# Altium schematic sheet 780-00021_rev1,pg1,3-Chan IR Thermocouple Apps Module.SchDoc
size C; PageSetup: Record=PageOptions|CenterHorizontal=True|CenterVertical=True|PrintScale=0.70|XCorrection=1.00|YCorrection=1.00|PrintKind=0|BorderSize=5000000|LeftOffset=0|BottomOffset=0|Orientation=2|PaperLength=1000|PaperWidth=1000|Scale=100|PaperSource=7|PrintQuality=-4|MediaType=1|DitherType=10|PaperKind=Tabloid 11 x 17in|PrintScaleMode=1
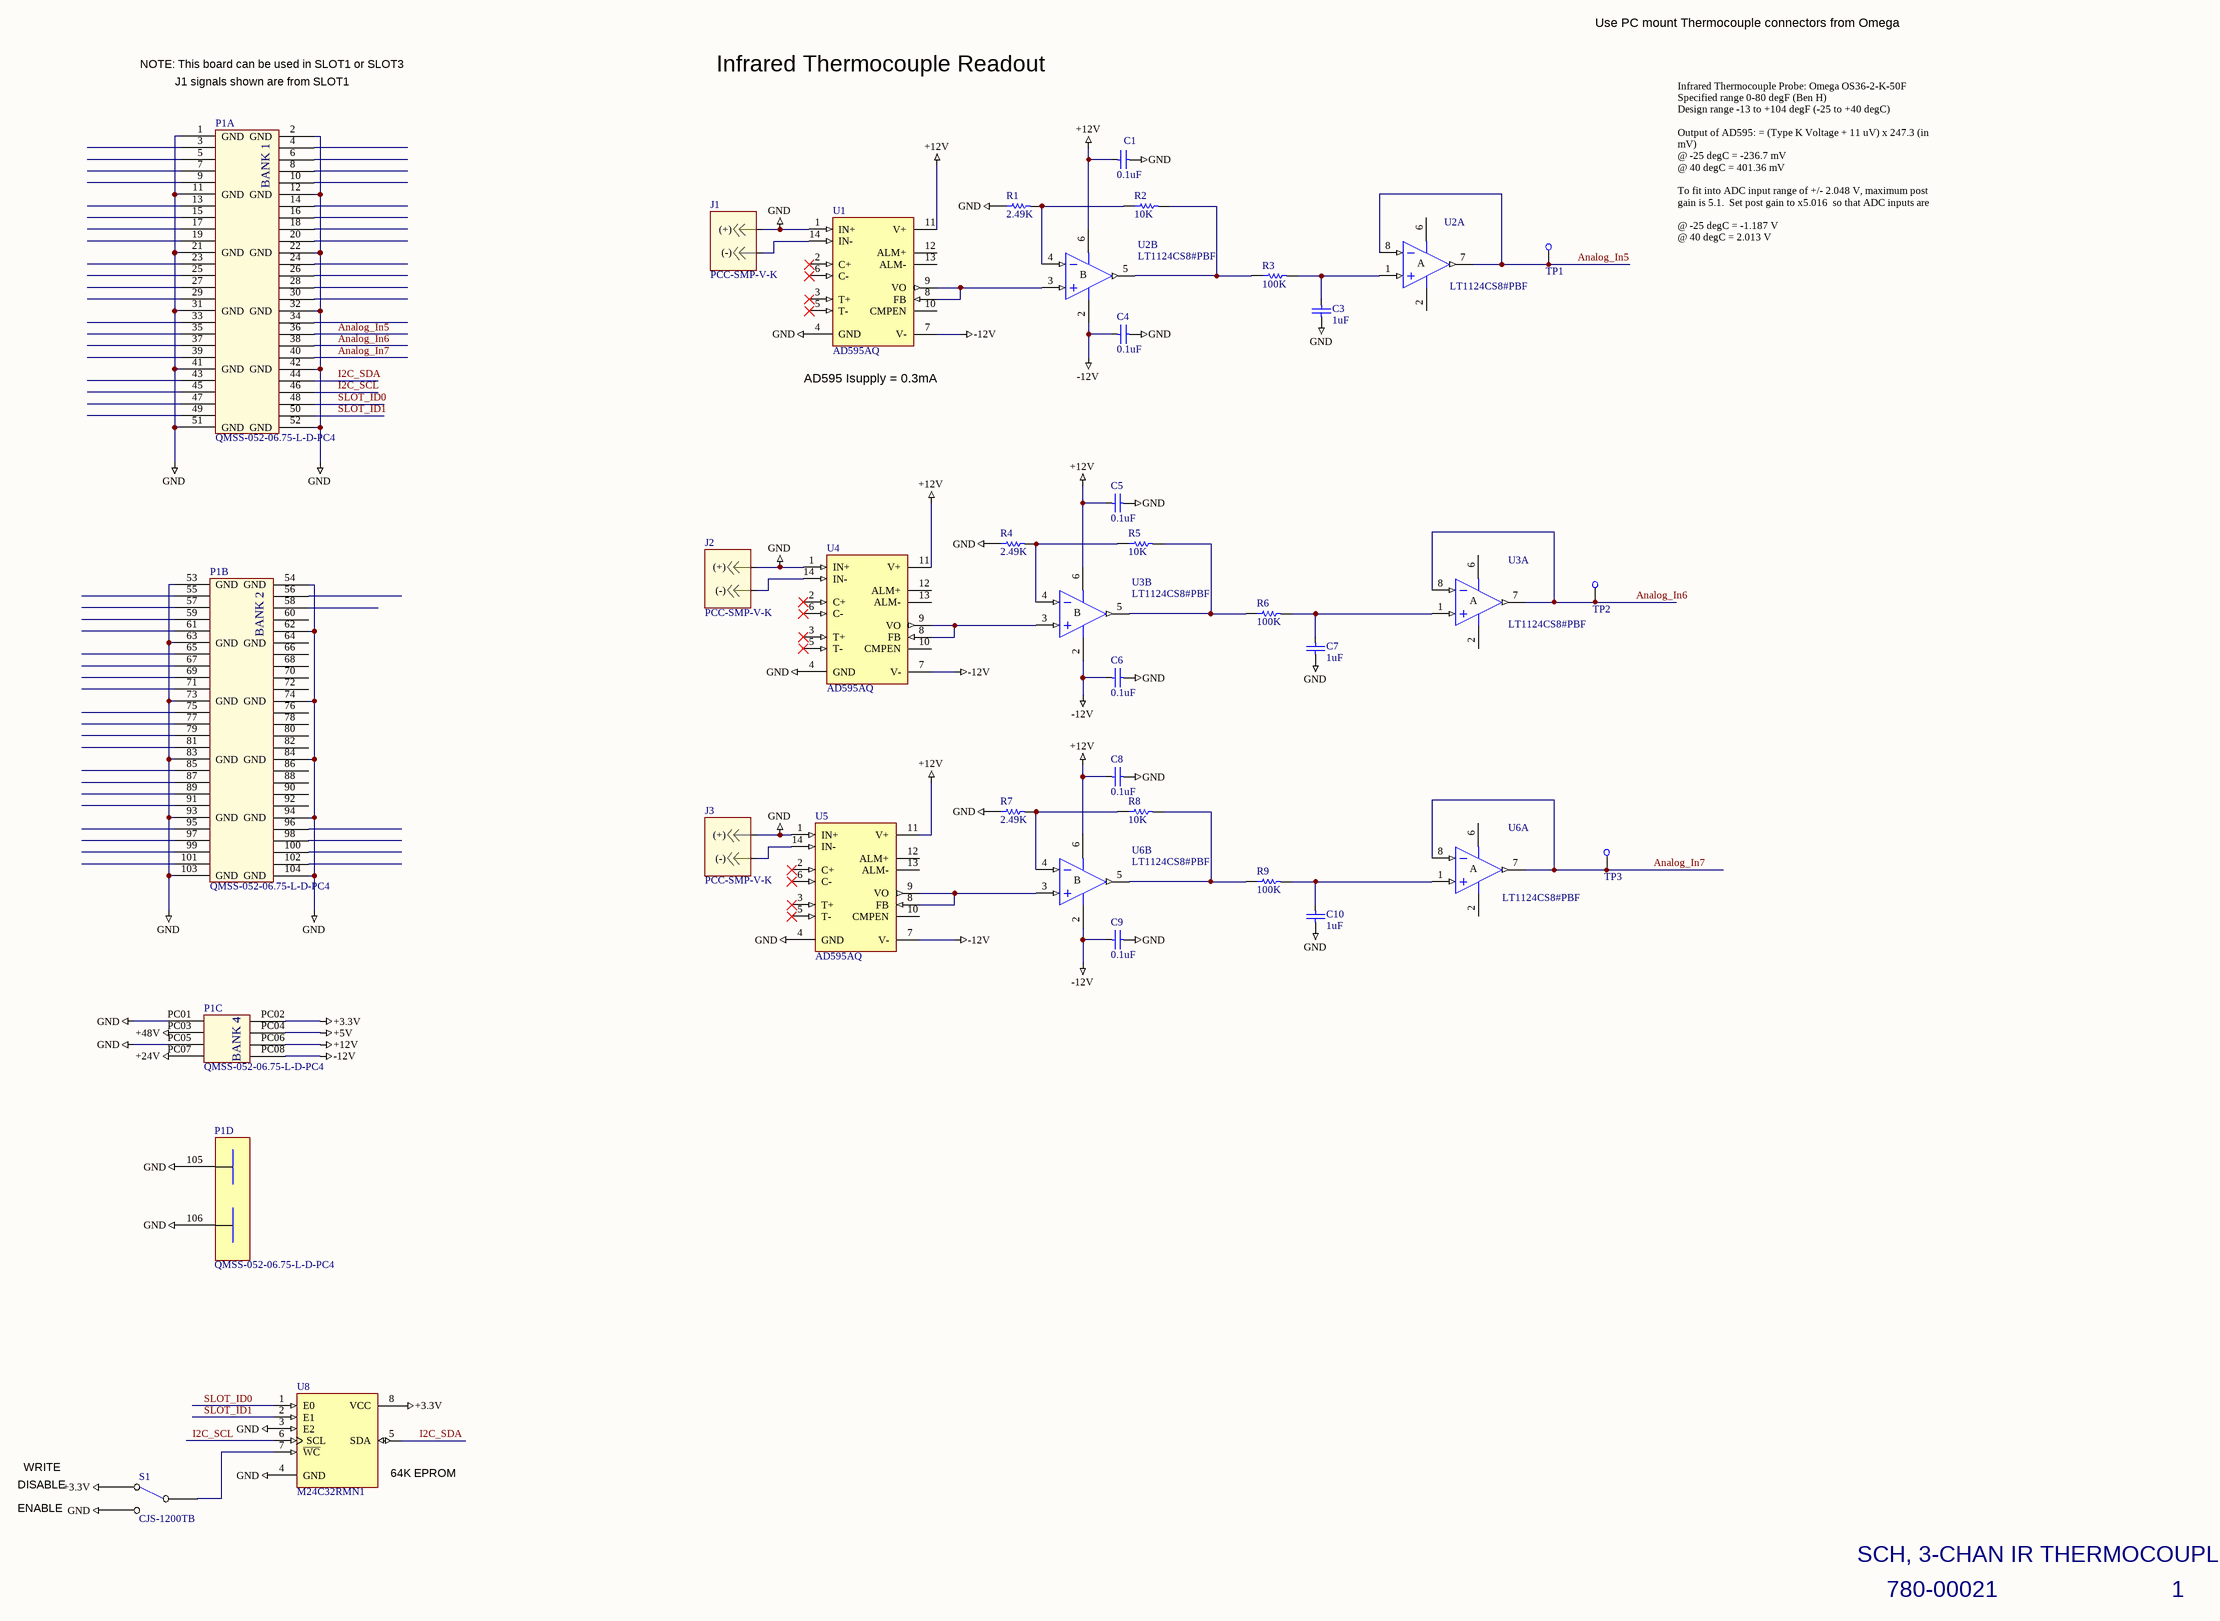
[diagram p0: 780-00021_rev1,pg1,3-Chan IR Thermocouple Apps Module.SchDoc]

## Parts
C1  value 0.1uF  [SMD_0805]  (hidden comment: Cap SMD)
C3  value 1uF  [SMD_0805]  (hidden comment: Cap SMD)
C4  value 0.1uF  [SMD_0805]  (hidden comment: Cap SMD)
C5  value 0.1uF  [SMD_0805]  (hidden comment: Cap SMD)
C6  value 0.1uF  [SMD_0805]  (hidden comment: Cap SMD)
C7  value 1uF  [SMD_0805]  (hidden comment: Cap SMD)
C8  value 0.1uF  [SMD_0805]  (hidden comment: Cap SMD)
C9  value 0.1uF  [SMD_0805]  (hidden comment: Cap SMD)
C10  value 1uF  [SMD_0805]  (hidden comment: Cap SMD)
J1  PCC-SMP-V-K  [THERMOCOUPLE, Vertical]
J2  PCC-SMP-V-K  [THERMOCOUPLE, Vertical]
J3  PCC-SMP-V-K  [THERMOCOUPLE, Vertical]
P1  QMSS-052-06.75-L-D-PC4  [QMS SMD PWR PINS - 104PIN]  (parts A,B,C,D of 4)
R1  value 2.49K  [SMD_0805]  (hidden comment: Res 0805)
R2  value 10K  [SMD_0805]  (hidden comment: Res 0805)
R3  value 100K  [SMD_0805]  (hidden comment: Res 0805)
R4  value 2.49K  [SMD_0805]  (hidden comment: Res 0805)
R5  value 10K  [SMD_0805]  (hidden comment: Res 0805)
R6  value 100K  [SMD_0805]  (hidden comment: Res 0805)
R7  value 2.49K  [SMD_0805]  (hidden comment: Res 0805)
R8  value 10K  [SMD_0805]  (hidden comment: Res 0805)
R9  value 100K  [SMD_0805]  (hidden comment: Res 0805)
S1  CJS-1200TB  [CAS-120B]
TP1  Test Point SMD  [SMD_TEST POINT]  (value not drawn)
TP2  Test Point SMD  [SMD_TEST POINT]  (value not drawn)
TP3  Test Point SMD  [SMD_TEST POINT]  (value not drawn)
U1  AD595AQ  [Q-14_A]
U2  LT1124CS8#PBF  [S8_N]  (parts A,B of 2)
U3  LT1124CS8#PBF  [S8_N]  (parts A,B of 2)
U4  AD595AQ  [Q-14_A]
U5  AD595AQ  [Q-14_A]
U6  LT1124CS8#PBF  [S8_N]  (parts A,B of 2)
U8  M24C32RMN1  [SOP8_N]

## Nets
+3.3V: P1.PC02 S1.3(NC) U8.8(VCC)
+5V: P1.PC04
+12V: C1.2 C5.2 C8.2 P1.PC06 U1.11(V+) U2.6(V+) U3.6(V+) U4.11(V+) U5.11(V+) U6.6(V+)
-12V: C4.2 C6.2 C9.2 P1.PC08 U1.7(V-) U2.2(V-) U3.2(V-) U4.7(V-) U5.7(V-) U6.2(V-)
GND: C1.1 C3.1 C4.1 C5.1 C6.1 C7.1 C8.1 C9.1 C10.1 J1.1((+)) J2.1((+)) J3.1((+)) P1.1(GND) P1.2(GND) P1.11(GND) P1.12(GND) P1.21(GND) P1.22(GND) P1.31(GND) P1.32(GND) P1.41(GND) P1.42(GND) P1.51(GND) P1.52(GND) P1.53(GND) P1.54(GND) P1.62 P1.63(GND) P1.73(GND) P1.74(GND) P1.83(GND) P1.84(GND) P1.93(GND) P1.94(GND) P1.103(GND) P1.104(GND) P1.105(GND) P1.106(GND) P1.PC01 P1.PC05 R1.1 R4.1 R7.1 S1.1(NO) U1.1(IN+) U1.4(GND) U4.1(IN+) U4.4(GND) U5.1(IN+) U5.4(GND) U8.3(E2) U8.4(GND)
Analog_In5: P1.36 TP1.1(TP) U2.7(OUT) U2.8(IN-)
Analog_In6: P1.38 TP2.1(TP) U3.7(OUT) U3.8(IN-)
Analog_In7: P1.40 TP3.1(TP) U6.7(OUT) U6.8(IN-)
I2C_SCL: P1.46 U8.6(SCL)
I2C_SDA: P1.44 U8.5(SDA)
SLOT_ID0: P1.48 U8.1(E0)
SLOT_ID1: P1.50 U8.2(E1)
NetC3_2: C3.2 R3.2 U2.1(IN+)
NetC7_2: C7.2 R6.2 U3.1(IN+)
NetC10_2: C10.2 R9.2 U6.1(IN+)
NetJ1_2: J1.2((-)) U1.14(IN-)
NetJ2_2: J2.2((-)) U4.14(IN-)
NetJ3_2: J3.2((-)) U5.14(IN-)
NetR1_2: R1.2 R2.1 U2.4(IN-)
NetR2_2: R2.2 R3.1 U2.5(OUT)
NetR4_2: R4.2 R5.1 U3.4(IN-)
NetR5_2: R5.2 R6.1 U3.5(OUT)
NetR7_2: R7.2 R8.1 U6.4(IN-)
NetR8_2: R8.2 R9.1 U6.5(OUT)
NetS1_2: S1.2(COM) U8.7(~{WC})
NetU1_8: U1.8(FB) U1.9(VO) U2.3(IN+)
NetU3_3: U3.3(IN+) U4.8(FB) U4.9(VO)
NetU5_8: U5.8(FB) U5.9(VO) U6.3(IN+)

Not connected (* = marked no-connect by the designer): P1 3 4 5 6 7 8 9 10 13 14 15 16 17 18 19 20 23 24 25 26 27 28 29 30 33 34 35 37 39 43 45 47 49 55 56 57 58 59 60 61 64(GND) 65 66 67 68 69 70 71 72 75 76 77 78 79 80 81 82 85 86 87 88 89 90 91 92 95 96 97 98 99 100 101 102 PC03 PC07; U1 2(C+)* 3(T+)* 5(T-)* 6(C-)* 10(CMPEN) 12(ALM+) 13(ALM-); U4 2(C+)* 3(T+)* 5(T-)* 6(C-)* 10(CMPEN) 12(ALM+) 13(ALM-); U5 2(C+)* 3(T+)* 5(T-)* 6(C-)* 10(CMPEN) 12(ALM+) 13(ALM-)

## Notes on the sheet
- Use PC mount Thermocouple connectors from Omega
- NOTE: This board can be used in SLOT1 or SLOT3
- J1 signals shown are from SLOT1
- Infrared Thermocouple Readout
- Infrared Thermocouple Probe: Omega OS36-2-K-50F
  Specified range 0-80 degF (Ben H)
  Design range -13 to +104 degF (-25 to +40 degC)
  Output of AD595: = (Type K Voltage + 11 uV) x 247.3 (in mV)
  @ -25 degC = -236.7 mV
  @ 40 degC = 401.36 mV
  To fit into ADC input range of +/- 2.048 V, maximum post gain is 5.1.  Set post gain to x5.016  so that ADC inputs are
  @ -25 degC = -1.187 V
  @ 40 degC = 2.013 V
- (near U1) AD595 Isupply = 0.3mA
- DISABLE
- WRITE
- (near U8) 64K EPROM
- ENABLE
- SCH, 3-CHAN IR THERMOCOUPLE
- 780-00021
- 1
- Labels drawn without touching a wire or pin: +24V, +48V
- (in symbol LT1124CS8#PBF, part A) A
- (in symbol LT1124CS8#PBF, part B) B
- (in symbol QMSS-PC4-104 pin, part A) BANK 1
- (in symbol QMSS-PC4-104 pin, part B) BANK 2
- (in symbol QMSS-PC4-104 pin, part C) BANK 4

## Library data of the parts
C1 C4-C6 C8 C9 = Cap SMD: Capacitor; LCO p/n: 120-00002
C3 C7 C10 = Cap SMD: Capacitor; LCO p/n: 120-00006
J1-J3 = Thermocouple Connector: T/C Conn PCB mount vertical; LCO p/n: 125-00042
P1 = QMSS-PC4-104 pin: SAMTEC QMSS W/PWR PINS; Vendor Mult.: 1; LCO p/n: 125-00056; Manufacturer: SAMTEC; Manuf p/n: QMSS-052-06.75-L-D-PC4; Vendor: SAMTEC; Vendor p/n: QMSS-052-06.75-L-D-PC4; COST: 18.33; VALUE: QMSS-052-06.75-L-D-PC4
R1 R4 R7 = Res SMD: Resistor 0805; Manufacturer: Vishay/Dale; Manuf p/n: CRCW08052.49KFKEA; Vendor: DIGIKEY; Vendor p/n: 541-2.49KCCT-ND; Vendor Mult.: 10; LCO p/n: 181-02491; COST: 0.09
R2 R5 R8 = Res SMD: Resistor 0805; Manufacturer: Vishay/Dale; Manuf p/n: CRCW080510KFKEA; Vendor: DIGIKEY; Vendor p/n: 541-10KCCT-ND; Vendor Mult.: 10; LCO p/n: 181-01002; COST: 0.09
R3 R6 R9 = Res SMD: Resistor 0805; Manufacturer: Vishay/Dale; Manuf p/n: CRCW0805100KFKEA; Vendor: DIGIKEY; Vendor p/n: 541-100KCCT-ND; Vendor Mult.: 10; LCO p/n: 181-01003; COST: 0.09
S1 = SW_SPDT_DOUG: Manufacturer: Copal Electronics; Manuf p/n: CAS-120TB; Vendor: DIGIKEY; Vendor Mult.: 1; Vendor p/n: CAS120JTR-ND; LCO p/n: 185-00010; COST: 1.27; Value: SW_SPDT
TP1-TP3 = Test Point SMD: SMD loop test point; LCO p/n: 160-00001; VALUE: Test Point SMD
U1 U4 U5 = AD595AQ: Monolithic Thermocouple Amplifier with Cold Junction Compensation; Manufacturer: Analog Devices; LCO p/n: 150-00066; Vendor: Digi-Key; Vendor Mult.: 1; Vendor p/n: AD595AQ-ND; COST: 12.35; Manuf p/n: AD595AQ; VALUE: AD595AQ
U2 U3 U6 = LT1124CS8#PBF: Dual Low Noise, High-Speed Precision Operational Amplifier; LCO p/n: 150-00006
U8 = M24C32RMN1: 32 Kbit Serial I²C Bus EEPROM; LCO p/n: 150-00076